# EAGLE design driver_fet (EAGLE 6.5.0)
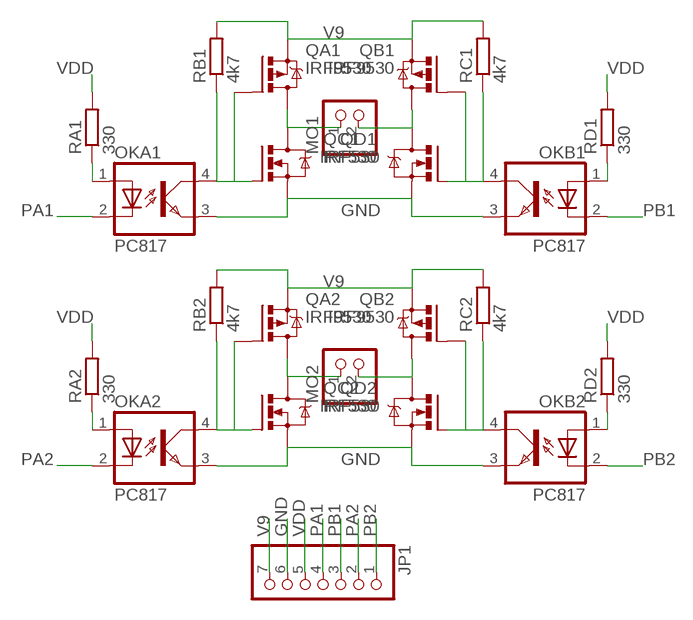
[diagram p0: schematic, sheet 1]

## Parts
JP1  PINHD-1X7  [1X07]
MO1  PINHD-1X2  [1X02]
MO2  PINHD-1X2  [1X02]
OKA1  PC817  [DIL04]
OKA2  PC817  [DIL04]
OKB1  PC817  [DIL04]
OKB2  PC817  [DIL04]
QA1  IRF9530  [TO220BV]
QA2  IRF9530  [TO220BV]
QB1  IRF9530  [TO220BV]
QB2  IRF9530  [TO220BV]
QC1  IRF530  [TO220BV]
QC2  IRF530  [TO220BV]
QD1  IRF530  [TO220BV]
QD2  IRF530  [TO220BV]
RA1  330  R-EU_R1206  [R1206]
RA2  330  R-EU_R1206  [R1206]
RB1  4k7  R-EU_R1206  [R1206]
RB2  4k7  R-EU_R1206  [R1206]
RC1  4k7  R-EU_R1206  [R1206]
RC2  4k7  R-EU_R1206  [R1206]
RD1  330  R-EU_R1206  [R1206]
RD2  330  R-EU_R1206  [R1206]

## Nets
GND: JP1.6 OKA1.3(EMIT) OKA2.3(EMIT) OKB1.3(EMIT) OKB2.3(EMIT) QC1.S QC2.S QD1.S QD2.S
N$1: MO1.1 QA1.D QC1.D
N$2: MO1.2 QB1.D QD1.D
N$3: MO2.1 QA2.D QC2.D
N$4: MO2.2 QB2.D QD2.D
N$5: OKA1.4(COL) QA1.G QC1.G RB1.1
N$6: OKB1.4(COL) QB1.G QD1.G RC1.1
N$7: OKA2.4(COL) QA2.G QC2.G RB2.1
N$8: OKA1.1(A) RA1.1
N$9: OKB1.1(A) RD1.1
N$10: OKB2.4(COL) QB2.G QD2.G RC2.1
N$13: OKA2.1(A) RA2.1
N$14: OKB2.1(A) RD2.1
PA1: JP1.4 OKA1.2(C)
PA2: JP1.2 OKA2.2(C)
PB1: JP1.3 OKB1.2(C)
PB2: JP1.1 OKB2.2(C)
V9: JP1.7 QA1.S QA2.S QB1.S QB2.S RB1.2 RB2.2 RC1.2 RC2.2
VDD: JP1.5 RA1.2 RA2.2 RD1.2 RD2.2

## Library data of the parts
JP1 = pinhead:PINHD-1X7: PIN HEADER
MO1 MO2 = pinhead:PINHD-1X2: PIN HEADER
OKA1 OKA2 OKB1 OKB2 = optocoupler:PC817: SHARP OPTO COUPLER; MPN: PC817X4J000F; OC_FARNELL: 9707727; OC_NEWARK: 97K7059
QA1 QA2 QB1 QB2 = transistor-power:IRF9530: P-CHANNEL HEXFET POWER-MOS-FET Source: http://www.irf.com/product-info/datasheets/data/irf9530.pdf
QC1 QC2 QD1 QD2 = transistor-power:IRF530: HEXFET Power MOSFET
RA1 RA2 RB1 RB2 RC1 RC2 RD1 RD2 = resistor:R-EU_: RESISTOR, European symbol

## Board
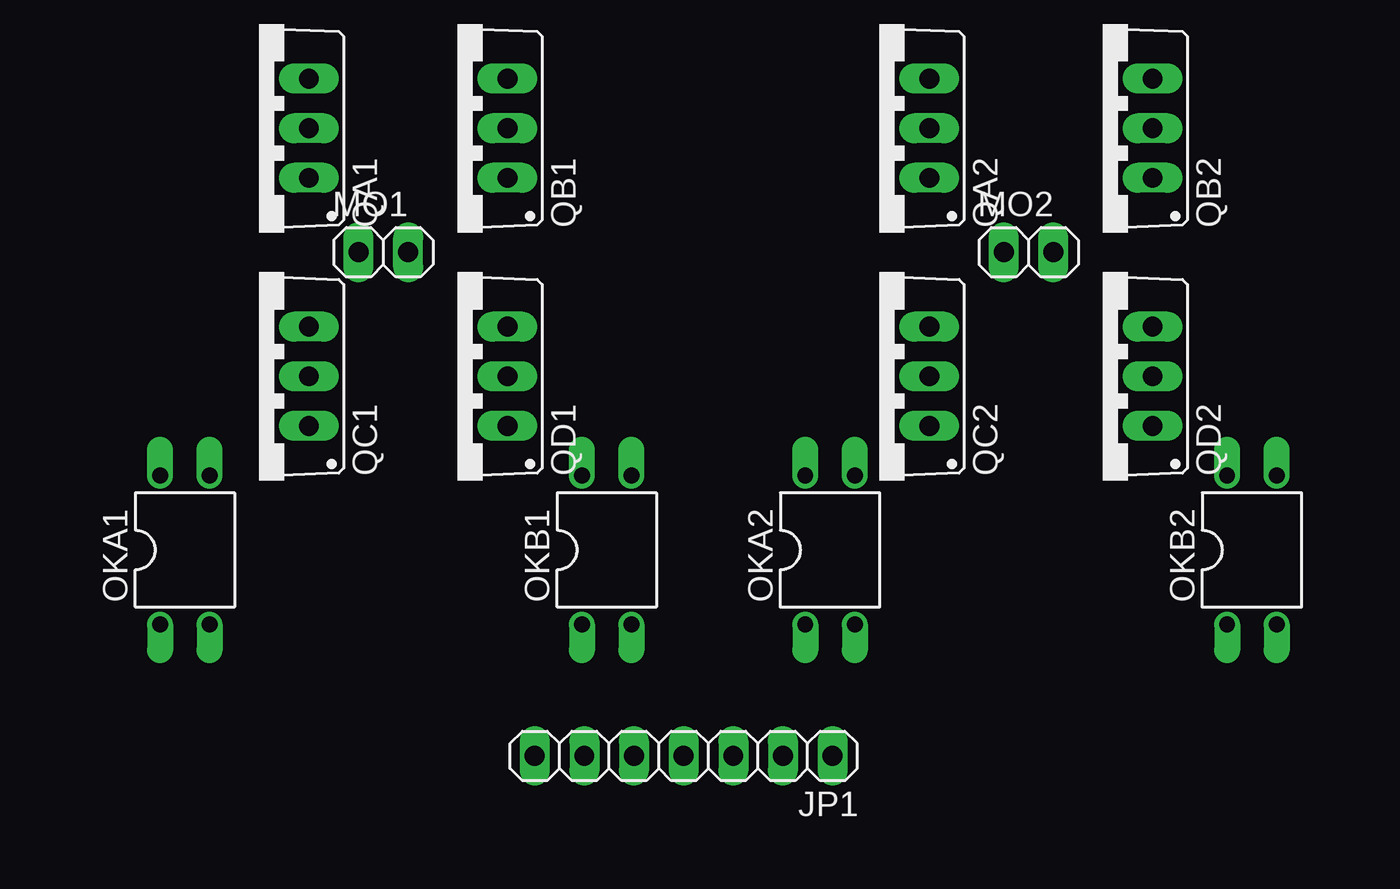
[diagram p1: board, top side]
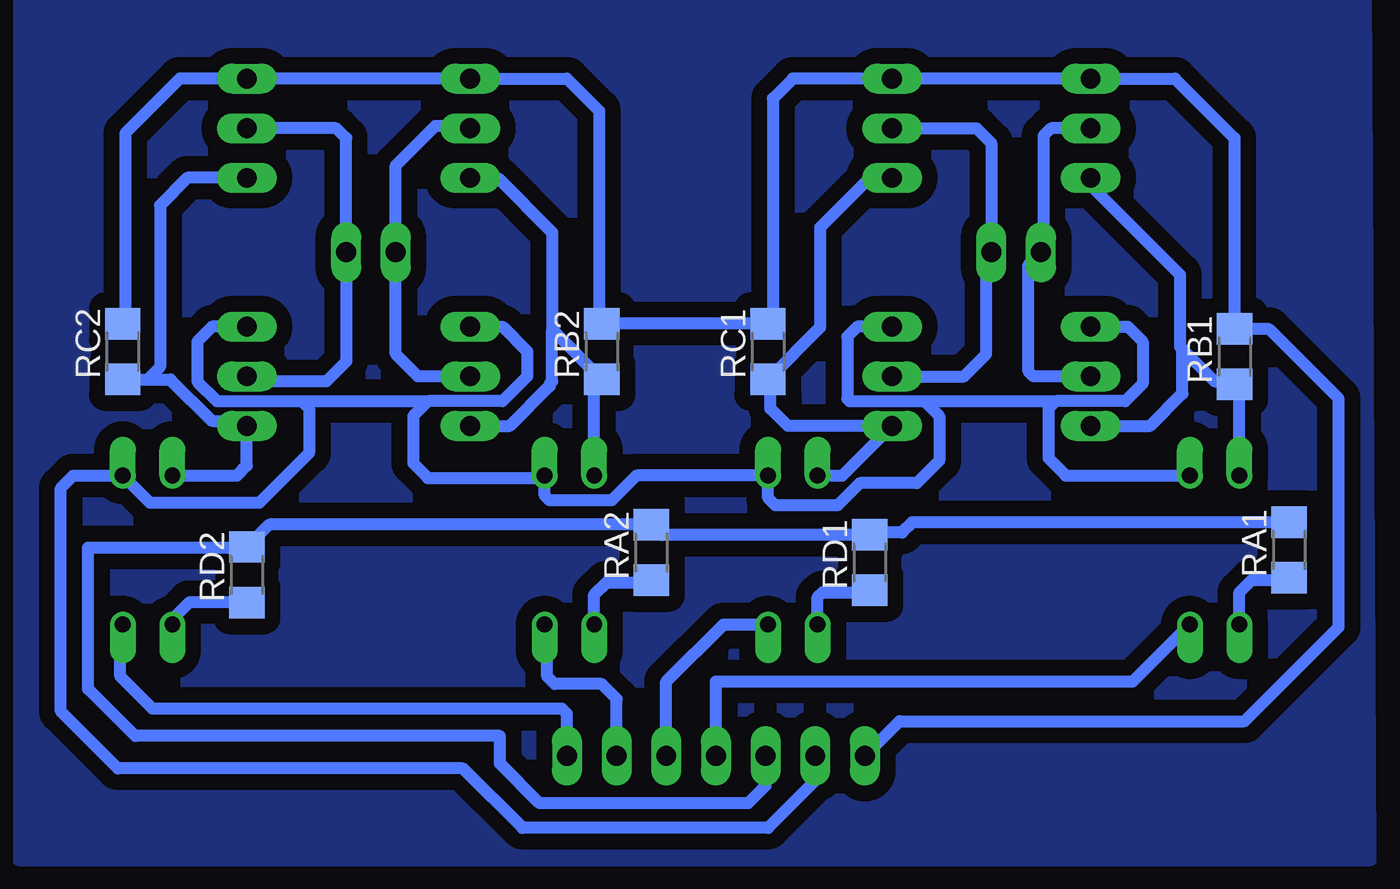
[diagram p2: board, bottom side, seen from below]

No outline drawn. Coordinates in mm, seen from the top.
Copper layers (1*16): Top 0.035mm / dielectric 1.5mm / Bottom 0.035mm
Design rules "default": minimum track width 10mil, minimum drill 24mil, track to track 8mil, track to pad 8mil, pad to pad 8mil, via to via 8mil, smd to smd 8mil, copper to edge 40mil, drill to drill 8mil, minimum pad ring 10mil, minimum via ring 8mil, stop-mask expansion 4mil, vias tented up to drill 0mil, thermal gap 10mil

### Footprints (pad centres in the part's own frame; a part is rotated, then mirrored left to right if it is on the bottom)
1X07 = drill 1.016 long: 1 -7.62,0; 2 -5.08,0; 3 -2.54,0; 4 0,0; 5 2.54,0; 6 5.08,0; 7 7.62,0
1X02 = drill 1.016 long: 1 -1.27,0; 2 1.27,0
DIL04 = drill 0.813 offset: 1 -1.27,-3.81; 2 1.27,-3.81; 3 1.27,3.81; 4 -1.27,3.81
TO220BV = drill 1.016 long: D 0,-2.54; G -2.54,-2.54; S 2.54,-2.54
R1206 = smd 1.6 x 1.803: 1 -1.422,0; 2 1.422,0

### Placement (x,y rotation side)
JP1  47.12,28.83 180 top
MO1  31.75,54.61 0 top
MO2  64.77,54.61 0 top
OKA1  21.59,39.37 0 top
OKA2  54.61,39.37 0 top
OKB1  43.18,39.37 0 top
OKB2  76.2,39.37 0 top
QA1  25.4,60.96 90 top
QA2  57.15,60.96 90 top
QB1  35.56,60.96 90 top
QB2  68.58,60.96 90 top
QC1  25.4,48.26 90 top
QC2  57.15,48.26 90 top
QD1  35.56,48.26 90 top
QD2  68.58,48.26 90 top
RA1  17.78,39.37 90 bottom
RA2  50.42,39.24 90 bottom
RB1  20.57,49.28 90 bottom
RB2  52.96,49.53 90 bottom
RC1  44.45,49.53 90 bottom
RC2  77.47,49.53 90 bottom
RD1  39.24,38.73 90 bottom
RD2  71.12,38.1 90 bottom

### Tracks (layer width: path | path; a pad name or v marks a point on that pad's centre or on a via)
GND
  Bottom 0.61: QC1.S 26.04,50.8 25.27,50.04 25.27,47.88 26.16,46.99 29.72,46.99 | 29.72,46.99 30.1,46.61 30.1,44.07 29.21,43.18 OKA1.3 | 36.45,46.99 40.26,46.99 40.39,47.12 40.39,50.29 39.88,50.8 QD1.S | 36.45,46.99 35.69,46.23 35.69,43.94 36.83,42.8 39.75,42.8 40.89,41.66 44.07,41.66 44.45,42.04 OKB1.3 51.18,43.18 52.45,41.91 55.63,41.91 55.88,42.16 OKA2.3 56.01,43.05 61.85,43.05 62.61,43.81 62.61,46.23 61.85,46.99 | 36.45,46.99 29.72,46.99 | QC2.S 58.04,50.8 56.77,49.53 56.77,48.26 58.04,46.99 61.85,46.99 | QD2.S 72.9,50.8 73.66,50.04 73.66,48.01 72.64,46.99 68.33,46.99 | 68.33,46.99 61.85,46.99 | 68.33,46.99 67.94,46.61 67.94,44.32 70.48,41.78 76.07,41.78 OKB2.3 80.01,43.18 80.64,42.55 80.64,31.11 77.72,28.19 60.07,28.19 57.02,25.15 44.45,25.15 42.04,27.56 JP1.6
N$1
  Bottom 0.61: QC1.D 30.86,48.26 31.11,48.51 31.11,53.98 MO1.1 30.35,54.74 30.35,60.58 29.97,60.96 QA1.D
N$2
  Bottom 0.61: QB1.D 33.78,60.96 33.02,60.2 MO1.2 33.27,54.36 33.27,49.4 34.42,48.26 QD1.D
N$3
  Bottom 0.61: QC2.D 62.36,48.26 63.5,49.4 MO2.1 63.5,59.05 61.47,61.09 59.82,61.09 QA2.D
N$4
  Bottom 0.61: QB2.D 66.55,60.96 66.04,60.45 MO2.2 66.04,49.02 67.06,48.01 70.87,48.01 QD2.D
N$5
  Bottom 0.61: QA1.G 27.94,58.04 23.37,53.47 23.37,49.78 23.3,49.72 23.24,49.66 | 23.24,49.66 21.59,48.01 20.73,48.01 RB1.1 20.32,47.6 OKA1.4 | QC1.G 24.89,45.72 23.24,47.37 23.24,49.66
N$6
  Bottom 0.61: OKB1.4 40.64,43.18 QD1.G 43.43,45.72 44.32,46.61 44.32,47.98 RC1.1 41.78,50.77 41.78,55.88 39.24,58.42 QB1.G
N$7
  Bottom 0.61: OKA2.4 53.34,47.73 RB2.1 55.5,50.65 | QA2.G 58.29,58.42 55.5,55.63 55.5,51.69 55.5,50.65 | QC2.G 57.66,45.72 55.63,47.75 55.63,47.88 55.5,48.01 55.5,50.65
N$8
  Bottom 0.61: OKA1.1 20.32,37.21 19.68,37.85 17.88,37.85 RA1.1
N$9
  Bottom 0.61: OKB1.1 41.91,36.96 41.66,37.21 39.34,37.21 RD1.1
N$10
  Bottom 0.61: OKB2.4 71.63,43.18 71.12,43.69 QD2.G 71.37,45.97 72.9,45.97 75.03,48.11 76.2,48.11 | RC2.1 76.2,48.11 | QB2.G 74.17,58.42 75.56,57.02 75.56,48.74 76.2,48.11
N$11
  pour Bottom (isolate 0.813): 13.84,68.33 82.8,68.07 82.8,23.5 13.59,23.5
N$13
  Bottom 0.61: OKA2.1 53.34,37.08 52.7,37.72 50.52,37.72 RA2.1
N$14
  Bottom 0.61: OKB2.1 74.93,35.81 74.04,36.7 71.14,36.7 RD2.1
PA1
  Bottom 0.61: JP1.4 47.12,32.64 25.78,32.64 OKA1.2
PA2
  Bottom 0.61: JP1.2 52.2,31.75 52.96,32.51 55.37,32.51 55.75,32.89 55.75,35.43 OKA2.2
PB1
  Bottom 0.61: JP1.3 49.66,32.64 46.74,35.56 OKB1.2
PB2
  Bottom 0.61: JP1.1 54.74,30.99 54.99,31.24 75.95,31.24 77.6,32.89 77.6,35.43 OKB2.2
V9
  Bottom 0.61: RC2.2 77.34,51.08 77.34,60.71 74.55,63.5 QB2.S QA2.S 54.74,63.5 53.09,61.85 53.09,51.08 RB2.2 RC1.2 44.2,51.21 44.2,62.48 43.18,63.5 QB1.S QA1.S 23.62,63.5 20.57,60.45 RB1.2 20.55,50.67 18.8,50.67 15.24,47.12 15.24,35.43 20.07,30.61 37.72,30.61 JP1.7
VDD
  Bottom 0.61: 50.29,40.79 RA2.2 | RA2.2 69.98,40.66 RD2.2 71.14,39.5 79.25,39.5 79.25,32.26 76.83,29.84 58.17,29.84 58.17,28.45 56.13,26.42 45.47,26.42 44.58,27.3 JP1.5 | RA1.2 37.06,40.79 37.59,40.26 39.5,40.26 39.75,40.01 39.4,40.01 RD1.2 39.34,40.16 39.37,40.13 49.89,40.13 RA2.2